# EAGLE design Sport Analyzer Teensy4 (EAGLE 9.6.2)
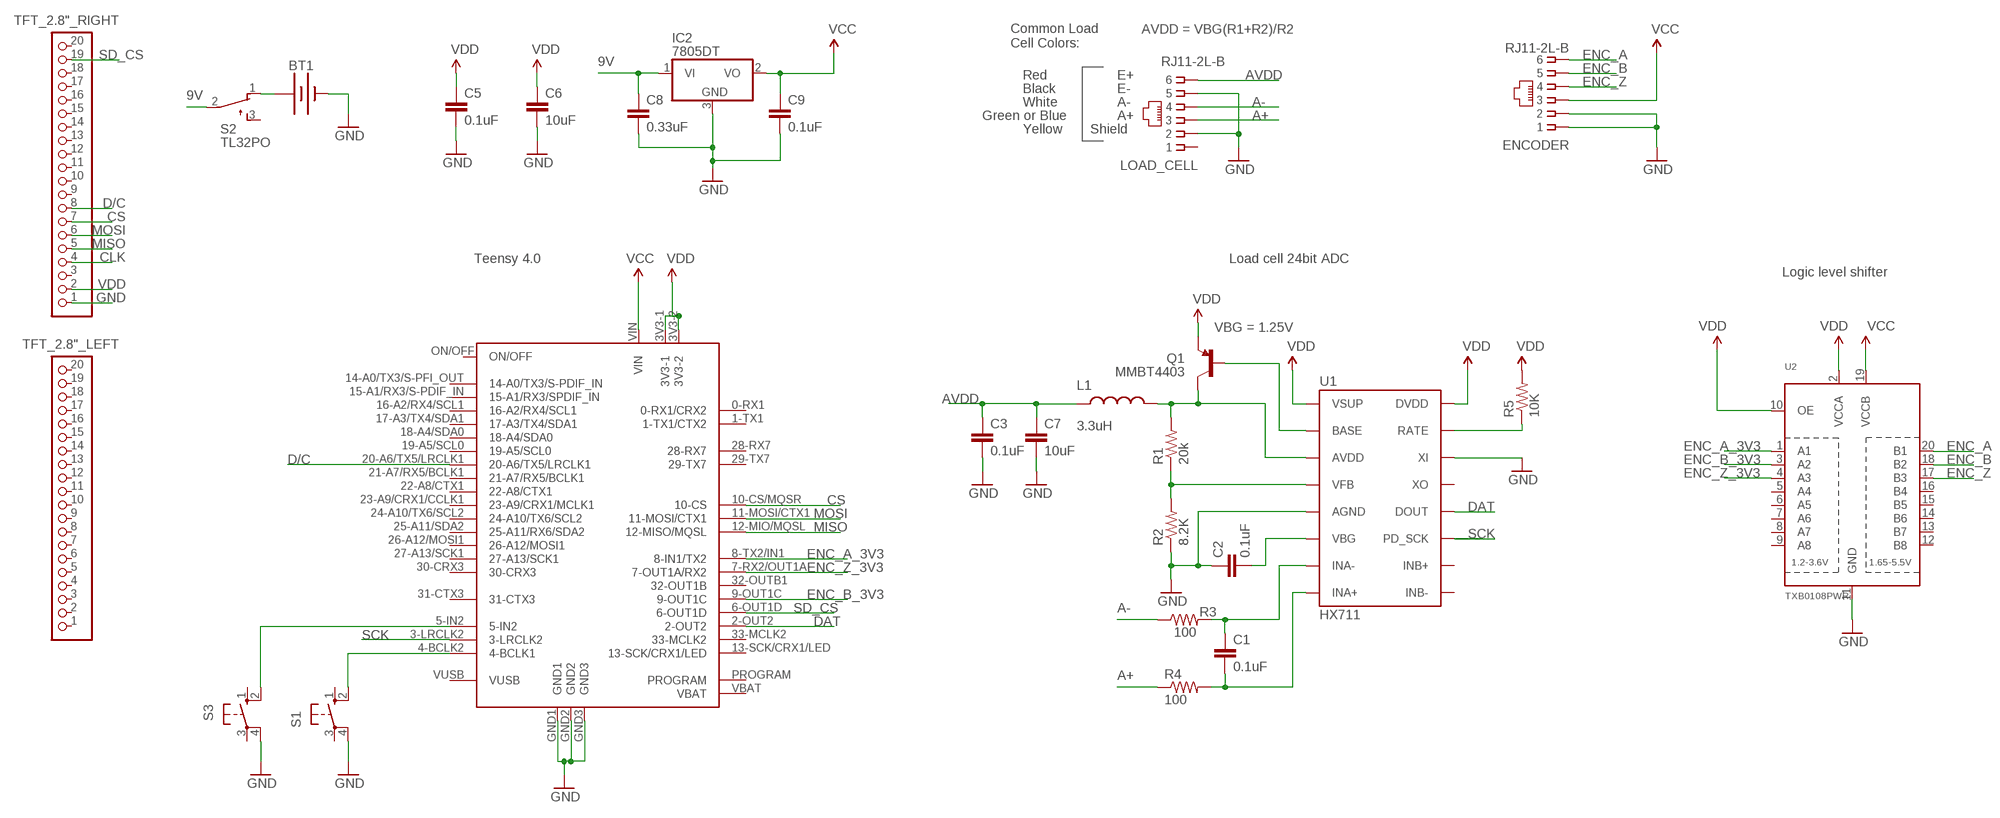
[diagram p0: schematic, sheet 1]

## Parts
BT1  BATTERY-9V  [BATTCON_9V]
C1  0.1uF  0.1UF-25V-5%(0603)  [0603-CAP]
C2  0.1uF  0.1UF-25V-5%(0603)  [0603-CAP]
C3  0.1uF  0.1UF-25V-5%(0603)  [0603-CAP]
C5  0.1uF  0.1UF-25V-5%(0603)  [0603-CAP]
C6  10uF  10UF50V20%(1210)  [1210]
C7  10uF  10UF50V20%(1210)  [1210]
C8  0.33uF  0.1UF-25V-5%(0603)  [0603-CAP]
C9  0.1uF  0.1UF-25V-5%(0603)  [0603-CAP]
ENCODER  RJ11-2L-B  [RJ11-NO_SHIELD]
IC2  7805DT  [TO252]
L1  3.3uH  INDUCTOR0805-IND  [0805]
LOAD_CELL  RJ11-2L-B  [RJ11-NO_SHIELD]
Q1  MMBT4403  TRANSISTOR_PNPMMBT4403  [SOT23-3]
R1  20k  20KOHM1/10W1%(0603)  [0603-RES]
R2  8.2K  8.2KOHM-1/10W-5%(0603)  [0603-RES]
R3  100  100OHM-1/10W-1%(0603)  [0603-RES]
R4  100  100OHM-1/10W-1%(0603)  [0603-RES]
R5  10K  10KOHM-1/10W-1%(0603)0603  [0603-RES]
S1  10-XX  [B3F-10XX]
S2  TL32PO  [TL3XPO]
S3  10-XX  [B3F-10XX]
TFT_2.8"_LEFT  PINHD-1X20  [1X20]
TFT_2.8"_RIGHT  PINHD-1X20  [1X20]
U1  HX711  HX711HX711  [SO16]
U2  TXB0108PWR  [TSSOP20]
U$2  TEENSY40  [TEENSY40]

## Nets
9V: C8.1 IC2.1(VI) S2.2(P)
A+: LOAD_CELL.3 R4.1
A-: LOAD_CELL.4 R3.1
AVDD: C3.1 C7.1 L1.1 LOAD_CELL.6
CLK: TFT_2.8"_RIGHT.4
CS: TFT_2.8"_RIGHT.7 U$2.10-CS/MQSR(10-CS)
D/C: TFT_2.8"_RIGHT.8 U$2.20-A6/TX5/LRCLK1
DAT: U1.12(DOUT) U$2.2-OUT2
ENC_A: ENCODER.6 U2.20(B1)
ENC_A_3V3: U2.1(A1) U$2.8-TX2/IN1(8-IN1/TX2)
ENC_B: ENCODER.5 U2.18(B2)
ENC_B_3V3: U2.3(A2) U$2.9-OUT1C
ENC_Z: ENCODER.4 U2.17(B3)
ENC_Z_3V3: U2.4(A3) U$2.7-RX2/OUT1A(7-OUT1A/RX2)
GND: BT1.- C2.1 C3.2 C5.2 C6.2 C7.2 C8.2 C9.2 ENCODER.1 ENCODER.2 IC2.3(GND) LOAD_CELL.2 LOAD_CELL.5 R2.1 S1.4(P1) S3.4(P1) TFT_2.8"_RIGHT.1 U1.5(AGND) U1.14(XI) U2.11(GND) U$2.GND1 U$2.GND2 U$2.GND3
MISO: TFT_2.8"_RIGHT.5 U$2.12-MIO/MQSL(12-MISO/MQSL)
MOSI: TFT_2.8"_RIGHT.6 U$2.11-MOSI/CTX1
N$1: R5.1 U1.15(RATE)
N$2: C1.1 R3.2 U1.7(INA-)
N$3: C1.2 R4.2 U1.8(INA+)
N$4: Q1.1(B) U1.2(BASE)
N$5: L1.2 Q1.3(C) R1.2 U1.3(AVDD)
N$6: R1.1 R2.2 U1.4(VFB)
N$7: C2.2 U1.6(VBG)
N$8: S1.2(S1) U$2.4-BCLK2(4-BCLK1)
N$9: S3.2(S1) U$2.5-IN2
N$42: BT1.+ S2.1(O)
SCK: U1.11(PD_SCK) U$2.3-LRCLK2
SD_CS: TFT_2.8"_RIGHT.19 U$2.6-OUT1D
VCC: C9.1 ENCODER.3 IC2.2(VO) U2.19(VCCB) U$2.VIN
VDD: C5.1 C6.1 Q1.2(E) R5.2 TFT_2.8"_RIGHT.2 U1.1(VSUP) U1.16(DVDD) U2.2(VCCA) U2.10(OE) U$2.3V3-1 U$2.3V3-2
Unconnected: LOAD_CELL.1 S1.1(S) S1.3(P) S2.3(S) S3.1(S) S3.3(P) TFT_2.8"_LEFT.1 TFT_2.8"_LEFT.2 TFT_2.8"_LEFT.3 TFT_2.8"_LEFT.4 TFT_2.8"_LEFT.5 TFT_2.8"_LEFT.6 TFT_2.8"_LEFT.7 TFT_2.8"_LEFT.8 TFT_2.8"_LEFT.9 TFT_2.8"_LEFT.10 TFT_2.8"_LEFT.11 TFT_2.8"_LEFT.12 TFT_2.8"_LEFT.13 TFT_2.8"_LEFT.14 TFT_2.8"_LEFT.15 TFT_2.8"_LEFT.16 TFT_2.8"_LEFT.17 TFT_2.8"_LEFT.18 TFT_2.8"_LEFT.19 TFT_2.8"_LEFT.20 TFT_2.8"_RIGHT.3 TFT_2.8"_RIGHT.9 TFT_2.8"_RIGHT.10 TFT_2.8"_RIGHT.11 TFT_2.8"_RIGHT.12 TFT_2.8"_RIGHT.13 TFT_2.8"_RIGHT.14 TFT_2.8"_RIGHT.15 TFT_2.8"_RIGHT.16 TFT_2.8"_RIGHT.17 TFT_2.8"_RIGHT.18 TFT_2.8"_RIGHT.20 U1.9(INB-) U1.10(INB+) U1.13(XO) U2.5(A4) U2.6(A5) U2.7(A6) U2.8(A7) U2.9(A8) U2.12(B8) U2.13(B7) U2.14(B6) U2.15(B5) U2.16(B4) U$2.0-RX1(0-RX1/CRX2) U$2.1-TX1(1-TX1/CTX2) U$2.13-SCK/CRX1/LED U$2.14-A0/TX3/S-PFI_OUT(14-A0/TX3/S-PDIF_IN) U$2.15-A1/RX3/S-PDIF_IN(15-A1/RX3/SPDIF_IN) U$2.16-A2/RX4/SCL1 U$2.17-A3/TX4/SDA1 U$2.18-A4/SDA0 U$2.19-A5/SCL0 U$2.21-A7/RX5/BCLK1 U$2.22-A8/CTX1 U$2.23-A9/CRX1/CCLK1(23-A9/CRX1/MCLK1) U$2.24-A10/TX6/SCL2 U$2.25-A11/SDA2(25-A11/RX6/SDA2) U$2.26-A12/MOSI1 U$2.27-A13/SCK1 U$2.28-RX7 U$2.29-TX7 U$2.30-CRX3 U$2.31-CTX3 U$2.32-OUTB1(32-OUT1B) U$2.33-MCLK2 U$2.ON/OFF U$2.PROGRAM U$2.VBAT U$2.VUSB

## Notes on the sheet
- AVDD = VBG(R1+R2)/R2
- Common Load
  Cell Colors:
- Red | E+
- Black | E-
- White | A-
- Green or Blue | A+
- Yellow | Shield
- Teensy 4.0 | Load cell 24bit ADC
- Logic level shifter
- VBG = 1.25V

## Library data of the parts
BT1 = SparkFun-Batteries:BATTERY: Battery - Single Cell A variety of battery chemistries, sizes, and footprints. Device List: 20MM_PTH - Coin Cell Battery Holder - 20mm (PTH) <https://www.sparkfun.com/products/783> 20MM_PTH_KIT- Coin Cell battery Holder - 20 mm (PTH) <http://www.sparkfun.com/products/783>kit version with special mask 6.8MM_PTH - Coin Cell Battery Holder - 6.8MM(SMD) <https://www.digikey.com/product-detail/en/seiko-instruments/MS621FE-FL11E/728-1057-ND/1889208?WT.srch=1&gclid=CNOQ5a6LzdQCFZS2wAodXCkE0g> 12MM_SMD - Coin Cell Battery Holder - 12mm (SMD) <https://www.sparkfun.com/products/10592> 12MM_PTH - Coin Cell Battery Holder - 12mm (PTH) <https://www.sparkfun.com/products/7948> 20MM_SMD - 20mm Coin Cell Battery Holder (SMD) (2 legs) Used on the Big Time Watch Kit <https://www.sparkfun.com/products/11734> 20MM_SMD_4LEGS - Coin Cell Battery Holder - 20mm (SMD) <https://www.sparkfun.com/products/11892> 20MM_SMD_4LEGS_OVERPASTE - Coin Cell Battery Holder - 20mm (SMD) <https://www.sparkfun.com/products/11892> (Over-paste on the legs) 24.5MM_PTH - Coin Cell Battery Holder - 24.5mm (PTH) <https://www.sparkfun.com/products/8863> 9V - 9V Battery Holder - PC Mount Used on the SparkFun SparkPunk Sound Kit <https://www.sparkfun.com/products/11177> and SparkFun SparkPunk Sequencer Kit <https://www.sparkfun.com/products/12707> 18650 - Battery Holder - 18650 (PTH) <https://www.sparkfun.com/products/13113> AA - Battery Holder - 1xAA (PTH) <https://www.sparkfun.com/products/7949> AAA - Battery Holder - 1xAAA (PTH) <https://www.sparkfun.com/products/12718> AA_KIT - Battery Holder - 1xAA (PTH) <https://www.sparkfun.com/products/7949> Special kit package - pads only have exposed copper on one side of the board. AAA_KIT - Battery Holder - 1xAAA (PTH) <https://www.sparkfun.com/products/12718> Special kit package - pads only have exposed copper on one side of the board.; PROD_ID: BATT-10855
C1-C3 C5 C9 = SparkFun-Capacitors:0.1UF-25V-5%(0603): CAP-08604; PROD_ID: CAP-08604
C6 C7 = SparkFun-Capacitors:10UF50V20%(1210): CAP-09824; PROD_ID: CAP-09824
C8 = SparkFun-Capacitors:0.1UF-25V-5%(0603): CAP-08604; PROD_ID: CAP-08604; VALUE: 0.1uF
ENCODER LOAD_CELL = con-tycoelectronics:RJ11: CORCOM Modular RJ Jacks No Shield Source: www.tycoelectronics.com .. ENG_DS_1654001_1099_RJ_L_0507.pdf; MF: TYCO ELECTRONICS; MPN: RJ11-2L-B; OC_FARNELL: unknown; OC_NEWARK: 83F4463
IC2 = linear:78*: Positive VOLTAGE REGULATOR Source: http://cache.national.com/ds/LM/LM78L05.pdf http://www.fairchildsemi.com/ds/LM/LM7805.pdf
L1 = SparkFun-Passives:INDUCTOR: Inductors Basic Inductor/Choke - 0603 and 1206. Footprints are not proven and vary greatly between part numbers. INDUCTOR POWER 3.3UH 4.0A SMD 0.197" L x 0.197" W x 0.177" H (5.00mm x 5.00mm x 4.50mm); PROD_ID: NDUC-13076
Q1 = SparkFun-DiscreteSemi:TRANSISTOR_PNP: Generic PNP BJT Double check pinouts against datasheets- not all devices are the same! MMBT3906 - 40V 200mA SOT-23 (TRANS-08052) MMBT4403 - 40V 600mA SOT-23 (TRANS-09245); PROD_ID: TRANS-09245
R1 = SparkFun-Resistors:20KOHM1/10W1%(0603): RES-09383; PROD_ID: RES-09383
R2 = SparkFun-Resistors:8.2KOHM-1/10W-5%(0603): RES-10646; PROD_ID: RES-10646
R3 R4 = SparkFun-Resistors:100OHM-1/10W-1%(0603): RES-07863; PROD_ID: RES-07863
R5 = SparkFun-Resistors:10KOHM-1/10W-1%(0603): RES-00824; PROD_ID: RES-00824
S1 S3 = switch-omron:10-XX: OMRON SWITCH; MPN: B3F-1000; OC_FARNELL: 176432; OC_NEWARK: 36M3542
S2 = switch:TL32PO: TINY SWITCH ON - MOM Source: http://www2.produktinfo.conrad.com/datenblaetter/700000-724999/705152-da-01-de-Subminiaturschalter_TL_36YO.pdf
TFT_2.8"_LEFT TFT_2.8"_RIGHT = pinhead:PINHD-1X20: PIN HEADER
U1 = Testing:HX711; PROD_ID: IC-12445
U2 = microbuilder:TXB0108PWR: 8-Bit Bi-Directional Level Shifter 1.2V-3.6V (VCCA) to 1.65V-5.5V (VCCB) bi-directional level shifter with auto direction sensing. Max data rate - VCCA 1.8V: 20Mbps (50ns), VCCA 3.3V: 100Mbps (10ns) Digikey: 296-21527-1-ND
U$2 = teensy:TEENSY40: Teensy 4.0 device including POGO pins for pins 24 - 33, but not yet pins for D+ and D-. Symbol layout is what works for me and may not suite everyone... that can be added or additional symbols can be created to be used in a modilied davie name.

## Board
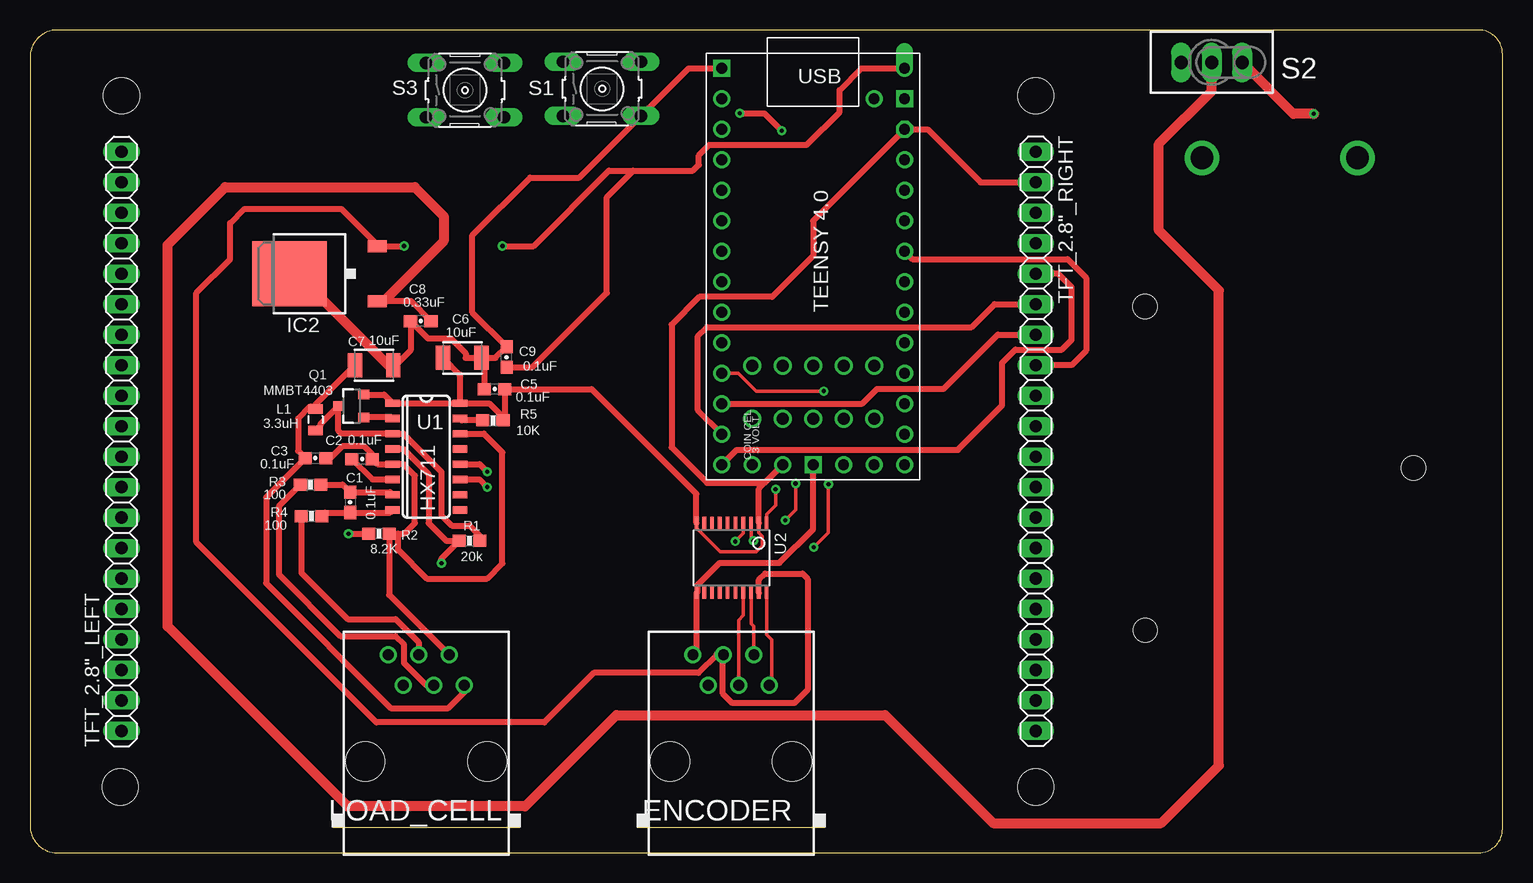
[diagram p1: board, top side]
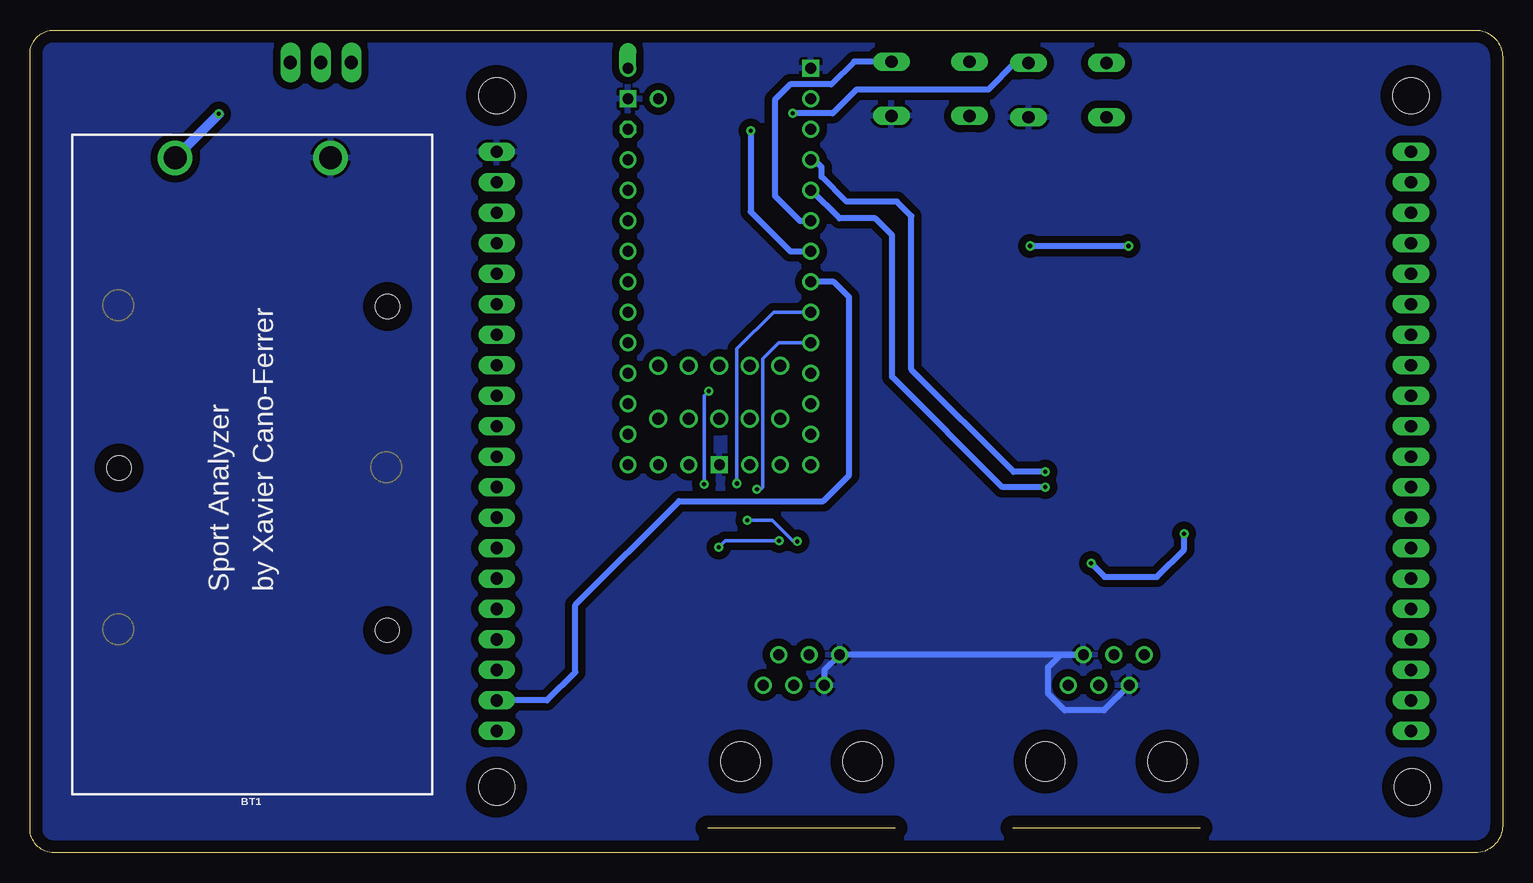
[diagram p2: board, bottom side, seen from below]

Size 122.71 x 68.57 mm. Coordinates in mm from the lower left corner, seen from the top.
Outline: 0,66.3 0,2.27 arc90 2.27,0 120.71,0 arc90 122.71,2 122.71,66.57 arc90 120.71,68.57 2.27,68.57 arc90 0,66.3
Copper layers (1*16): Top 0.035mm / dielectric 1.5mm / Bottom 0.035mm
Design rules "default": minimum track width 6mil, minimum drill 0.35mm, track to track 6mil, track to pad 6mil, pad to pad 6mil, via to via 6mil, smd to smd 6mil, copper to edge 40mil, drill to drill 6mil, minimum pad ring 10mil, minimum via ring 8mil, stop-mask expansion 4mil, vias tented up to drill 0mil, thermal gap 10mil
Holes 3 mm at 7.62,63.1 83.82,5.48 83.82,63.1 7.52,5.48
Holes 2 mm at 92.92,45.53 115.29,32.07 92.93,18.55

### Footprints (pad centres in the part's own frame; a part is rotated, then mirrored left to right if it is on the bottom)
BATTCON_9V = drill 1.905: + 0,0; - 0,-12.954
0603-CAP = smd 1.1 x 1: 1 -0.85,0; 2 0.85,0
1210 = smd 1.2 x 2: 1 -1.6,0; 2 1.6,0
RJ11-NO_SHIELD = drill 0.9 pad 1.4: 1 -3.175,8.89; 2 -1.905,6.35; 3 -0.635,8.89; 4 0.635,6.35; 5 1.905,8.89; 6 3.175,6.35 | hole 3.251: -5.08,0; 5.08,0
TO252 = smd 1 x 1.6: 1 -2.28,-4.8; 2 2.28,-4.8 | smd 5.4 x 6.2: 3 0,2.5
0805 = smd 0.8 x 1.2: 1 -0.9,0; 2 0.9,0
SOT23-3 = smd 0.8 x 0.9: 1 -0.95,-1; 2 0.95,-1; 3 0,1.1
0603-RES = smd 1.1 x 1: 1 -0.85,0; 2 0.85,0
B3F-10XX = drill 1.016 long: 1 -3.251,2.261; 2 3.251,2.261; 3 -3.251,-2.261; 4 3.251,-2.261
TL3XPO = drill 1.1 pad 1.422 long: 1 -2.54,0; 2 0,0; 3 2.54,0
1X20 = drill 1.016 long: 1 -24.13,0; 2 -21.59,0; 3 -19.05,0; 4 -16.51,0; 5 -13.97,0; 6 -11.43,0; 7 -8.89,0; 8 -6.35,0; 9 -3.81,0; 10 -1.27,0; 11 1.27,0; 12 3.81,0; 13 6.35,0; 14 8.89,0; 15 11.43,0; 16 13.97,0; 17 16.51,0; 18 19.05,0; 19 21.59,0; 20 24.13,0
SO16 = smd 0.6 x 1.2: 1 -4.445,-2.8; 2 -3.175,-2.8; 3 -1.905,-2.8; 4 -0.635,-2.8; 5 0.635,-2.8; 6 1.905,-2.8; 7 3.175,-2.8; 8 4.445,-2.8; 9 4.445,2.8; 10 3.175,2.8; 11 1.905,2.8; 12 0.635,2.8; 13 -0.635,2.8; 14 -1.905,2.8; 15 -3.175,2.8; 16 -4.445,2.8
TSSOP20 = smd 0.305 x 0.991: 1 -2.925,-2.918; 2 -2.275,-2.918; 3 -1.625,-2.918; 4 -0.975,-2.918; 5 -0.325,-2.918; 6 0.325,-2.918; 7 0.975,-2.918; 8 1.625,-2.918; 9 2.275,-2.918; 10 2.925,-2.918; 11 2.925,2.918; 12 2.275,2.918; 13 1.625,2.918; 14 0.975,2.918; 15 0.325,2.918; 16 -0.325,2.918; 17 -0.975,2.918; 18 -1.625,2.918; 19 -2.275,2.918; 20 -2.925,2.918
TEENSY40 = drill 0.9: 0-RX1 -13.97,-7.62; 1-TX1 -11.43,-7.62; 2-OUT2 -8.89,-7.62; 3-LRCLK2 -6.35,-7.62; 3V3-2 16.51,-2.54; 4-BCLK2 -3.81,-7.62; 5-IN2 -1.27,-7.62; 6-OUT1D 1.27,-7.62; 7-RX2/OUT1A 3.81,-7.62; 8-TX2/IN1 6.35,-7.62; 9-OUT1C 8.89,-7.62; 10-CS/MQSR 11.43,-7.62; 11-MOSI/CTX1 13.97,-7.62; 12-MIO/MQSL 16.51,-7.62; 13-SCK/CRX1/LED 16.51,7.62; 14-A0/TX3/S-PFI_OUT 13.97,7.62; 15-A1/RX3/S-PDIF_IN 11.43,7.62; 16-A2/RX4/SCL1 8.89,7.62; 17-A3/TX4/SDA1 6.35,7.62; 18-A4/SDA0 3.81,7.62; 19-A5/SCL0 1.27,7.62; 20-A6/TX5/LRCLK1 -1.27,7.62; 21-A7/RX5/BCLK1 -3.81,7.62; 22-A8/CTX1 -6.35,7.62; 23-A9/CRX1/CCLK1 -8.89,7.62; ON/OFF 16.51,5.08; PROGRAM 16.51,2.54; VBAT 16.51,-5.08; VUSB -13.97,5.08 | drill 0.9 octagon: 3V3-1 -11.43,7.62 | drill 1: 24-A10/TX6/SCL2 12.7,5.08; 25-A11/SDA2 8.255,5.08; 26-A12/MOSI1 12.7,2.54; 27-A13/SCK1 8.255,2.54; 28-RX7 12.7,0; 29-TX7 8.255,0; 30-CRX3 12.7,-2.54; 31-CTX3 8.255,-2.54; 32-OUTB1 12.7,-5.08; 33-MCLK2 8.255,-5.08 | drill 0.9 square: GND1 -16.51,-7.62; GND2 16.51,0; GND3 -13.97,7.62 | drill 0.9 offset: VIN -16.51,7.62

### Placement (x,y rotation side)
BT1  110.62,57.91 90 bottom
C1  26.67,29.21 270 top
C2  27.67,32.82 180 top
C3  23.79,32.89 0 top
C5  38.71,38.64 180 top
C6  36.03,41.24 0 top
C7  28.67,40.64 0 top
C8  32.56,44.32 180 top
C9  39.71,41.32 90 top
ENCODER  58.42,7.62 0 top
IC2  24.13,48.26 90 top
L1  23.79,36.1 270 top
LOAD_CELL  33.02,7.62 0 top
Q1  26.8,37.23 90 top
R1  36.63,26 0 top
R2  29.08,26.6 180 top
R3  23.39,30.68 0 top
R4  23.46,28.07 0 top
R5  38.57,36.03 0 top
S1  47.67,63.67 0 top
S2  98.47,65.87 180 top
S3  36.25,63.56 0 top
TFT_2.8"_LEFT  7.62,34.29 90 top
TFT_2.8"_RIGHT  83.82,34.29 270 top
U1  33.02,33.02 270 top
U2  58.46,24.58 180 top
U$2  65.26,48.86 270 top

### Tracks (layer width: path | path; a pad name or v marks a point on that pad's centre or on a via)
9V
  Top 0.508: C8.1 31.75,45.98 29.47,45.98 IC2.1
  Top 0.813: 29.47,45.98 34.47,50.98 34.47,53.07 32.07,55.47 16.27,55.47 11.47,50.67 11.47,18.87 26.47,3.87 41.27,3.87 48.87,11.47 71.27,11.47 80.27,2.47 94.27,2.47 99.07,7.27 99.07,46.87 94.07,51.87 94.07,59.08 98.47,63.48 S2.2
A+
  Top 0.508: R4.1 22.61,23.33 26.47,19.47 30.47,19.47 32.38,17.55 LOAD_CELL.3
A-
  Top 0.508: LOAD_CELL.4 33.02,13.97 31.16,15.83 31.16,17.37 30.45,18.07 25.87,18.07 20.74,23.2 20.74,28.88 R3.1
AVDD
  Top 0.508: C7.1 23.79,37.36 L1.1 23.62,37.17 23.32,37.17 22.34,36.19 22.34,33.49 C3.1 19.67,29.62 19.67,22.47 30.07,12.07 34.87,12.07 36.2,13.39 LOAD_CELL.6
CS
  Top 0.508: U$2.10-CS/MQSR 69.37,37.43 70.6,38.66 76.14,38.66 80.66,43.18 TFT_2.8"_RIGHT.7
D/C
  Top 0.508: U$2.20-A6/TX5/LRCLK1 73.53,49.48 86.46,49.48 88.02,47.92 88.02,41.85 86.81,40.64 TFT_2.8"_RIGHT.8
DAT  (via drill 0.35)
  Top 0.508: U1.12 37.47,32.38 v38.1,31.75
  Bottom 0.508: v38.1,31.75 40.75,31.75 49.27,40.27 49.27,53.07 50.47,54.27 54.68,54.27 56.74,56.33 56.74,57.14 57.35,57.75 U$2.2-OUT2
ENC_A
  Top 0.305: U2.20 61.39,18.18 61.81,17.75 61.81,14.18 ENCODER.6
ENC_A_3V3  (via drill 0.35)
  Top 0.305: v62.13,30.29 62.13,28.97 61.39,28.22 U2.1
  Bottom 0.305: U$2.8-TX2/IN1 60.31,42.51 61.65,41.17 61.65,30.46 61.82,30.29 v62.13,30.29
ENC_B
  Top 0.305: U2.18 60.09,19.09 60.3,18.88 60.33,18.86 ENCODER.5
ENC_B_3V3  (via drill 0.35)
  Top 0.305: U$2.9-OUT1C 59.02,39.97 60.51,38.48 v66.15,38.48 | v66.54,30.72 66.54,26.69 v65.32,25.47 | v60.29,26 60.09,26.2 U2.3
  Bottom 0.305: v66.15,38.48 66.54,38.09 v66.54,30.72 | v65.32,25.47 64.79,26 v60.29,26
ENC_Z
  Top 0.305: ENCODER.4 59.05,19.39 59.45,19.79 59.45,21.65 U2.17
ENC_Z_3V3  (via drill 0.35)
  Top 0.305: v63.8,30.78 63.8,28.59 v62.93,27.72 | v58.76,25.95 59.44,26.62 U2.4
  Bottom 0.305: U$2.7-RX2/OUT1A 60.74,45.05 63.8,41.99 v63.8,30.78 | v62.93,27.72 60.86,27.72 59.09,25.95 v58.76,25.95
GND
  Top 0.508: C2.1 28.95,32.38 U1.5 31.11,32.38 32.07,31.43 32.07,27.47 31.2,26.6 30.67,26.6 | C2.1 28.32,33.02 | 35.78,34.89 U1.14 37.82,34.93 39.37,33.38 39.37,24.13 38.1,22.86 33.07,22.86 30.67,25.26 30.67,26.6 | C7.2 30.47,40.64 31.71,41.88 C8.2 33.16,42.87 35.07,42.87 36.3,41.64 36.3,41.24 C6.2 | C2.1 28.52,33.22 27.87,33.87 26.02,33.87 25.04,32.89 C3.2 | C6.2 37.86,41.01 C5.2 | C6.2 38.78,41.24 C9.2 36.87,45.01 36.87,51.47 41.67,56.27 45.78,56.27 S1.4 54.88,65.37 U$2.GND1 | 30.67,26.6 R2.1 29.93,21.5 LOAD_CELL.5 | ENCODER.1 55.54,16.8 U2.11 55.63,21.75 55.63,22.33 57.47,24.17 62.45,24.17 65.26,26.98 U$2.GND2
  Top 0.813: IC2.3 22.23,48.26 29.85,40.64 C7.2
  Bottom 0.508: LOAD_CELL.2 33.22,11.87 36.47,11.87 37.87,13.27 37.87,15.47 36.83,16.51 LOAD_CELL.5 ENCODER.1 56.52,15.24 ENCODER.2
  pour Bottom (isolate 0.61): 120.84,68.58 2,68.58 arc90 -0.09,66.49 -0.09,2.09 arc90 2,0 121.57,0 122.84,1.27 122.84,66.58 arc90
MISO
  Top 0.508: U$2.12-MIO/MQSL 58.88,33.59 77.32,33.59 81.01,37.28 81.01,40.83 82.11,41.93 85.99,41.93 86.8,42.74 86.8,47.14 85.68,48.26 TFT_2.8"_RIGHT.5
MOSI
  Top 0.508: U$2.11-MOSI/CTX1 57.64,34.91 55.66,36.89 55.66,43.05 56.42,43.81 78.47,43.81 80.38,45.72 TFT_2.8"_RIGHT.6
N$1
  Top 0.508: R5.1 35.99,36.03 U1.15
N$2
  Top 0.508: R3.2 26.05,30.68 C1.1 30,30.06 U1.7
N$3
  Top 0.508: U1.8 30,28.36 C1.2 24.6,28.36 R4.2
N$4
  Top 0.508: U1.2 30.13,36.28 Q1.1
N$5
  Top 0.508: R1.2 37.48,26.42 36.63,27.27 35.16,27.27 34.29,28.14 34.29,31.75 31.11,34.93 U1.3 25.93,34.93 25.7,35.16 Q1.3 24.22,35.75 24.22,35.63 L1.2
N$6  (via drill 0.35)
  Top 0.508: U1.4 31.11,33.66 33.22,31.55 33.22,27.47 34.69,26 R1.1 34.29,24.51 v34.29,24.13 | v26.54,26.6 R2.2
  Bottom 0.508: v34.29,24.13 33.15,22.99 28.81,22.99 26.54,25.26 v26.54,26.6
N$7
  Top 0.508: C2.2 28.52,31.11 U1.6
N$8
  Bottom 0.508: S1.2 54.04,65.93 55.94,64.03 59.36,64.03 60.64,62.75 60.64,54.75 58.56,52.67 U$2.4-BCLK2
N$9  (via drill 0.35)
  Top 0.508: v59.14,61.62 61.19,61.62 62.63,60.18 v62.65,60.18
  Bottom 0.508: S3.2 40.63,65.82 42.85,63.6 53.84,63.6 55.82,61.62 v59.14,61.62 | v62.65,60.18 62.65,53.43 59.35,50.13 U$2.5-IN2
N$42  (via drill 0.35)
  Top 0.813: v106.98,61.59 105.29,61.59 S2.1
  Bottom 0.813: BT1.+ 106.98,61.55 v106.98,61.59
SCK  (via drill 0.35)
  Top 0.508: U1.11 37.47,31.11 v38.1,30.48
  Bottom 0.508: v38.1,30.48 41.68,30.48 50.87,39.67 50.87,51.47 52.27,52.87 55.25,52.87 57.59,55.21 U$2.3-LRCLK2
SD_CS
  Bottom 0.508: TFT_2.8"_RIGHT.19 79.64,12.7 77.27,15.07 77.27,20.67 68.62,29.32 56.61,29.32 54.45,31.48 54.45,46.31 55.73,47.59 U$2.6-OUT1D
VCC  (via drill 0.35)
  Top 0.508: 50.27,56.84 48.24,56.84 41.97,50.57 v39.37,50.57 | 50.27,56.84 48.07,54.64 48.07,46.67 41.87,40.47 C9.1 | 50.27,56.84 55.24,56.84 55.74,57.34 55.74,58.13 56.6,58.99 64.72,58.99 67.46,61.73 67.46,63.57 69.26,65.37 U$2.VIN | v31.17,50.57 31.07,50.47 31,50.54 IC2.2 29.07,50.54 25.94,53.67 17.87,53.67 16.67,52.47 16.67,49.47 13.87,46.67 13.87,25.87 28.87,10.87 42.87,10.87 47,15 55.71,15 57.22,16.51 ENCODER.3 57.73,16.46 57.73,13.27 58.53,12.47 63.67,12.47 64.81,13.61 64.81,22.84 64.38,23.27 61.25,23.27 60.74,22.75 U2.19
  Bottom 0.508: v31.17,50.57 39.17,50.57 39.27,50.47 v39.37,50.57
VDD
  Top 0.305: U2.10 55.55,27.48 55.55,27.06 57.5,25.1 60.54,25.1 61.02,25.58 61.02,26.4 60.74,26.68 U2.2
  Top 0.508: Q1.2 29.5,38.18 U1.1 U1.16 | C6.1 35.82,39.85 U1.16 | 39.56,36.17 C5.1 46.8,38.64 55.54,29.91 U2.10 | 39.56,36.17 R5.2 | U1.16 38.27,37.47 39.56,36.17 | U2.2 60.74,30.32 62.72,32.31 U$2.3V3-2 61.21,30.84 56.42,30.84 53.47,33.79 53.47,44.01 55.79,46.33 61.84,46.33 65.25,49.74 65.25,52.66 U$2.3V3-1 74.81,60.29 79.22,55.88 TFT_2.8"_RIGHT.2

### Text on the board
bNames: by Xavier Cano-Ferrer | Sport Analyzer